# Altium schematic sheet HEADERS_UNOQ_FEMALE.SchDoc: HEADERS UNO Q FEMALE
size A3; Author: Silvio Navaretti; CompanyName: Arduino SRL; DrawnBy: Silvio Navaretti; Engineer: Silvio Navaretti; Organization: Arduino SRL; DocumentNumber: ASX00083; SheetNumber: 3; SheetTotal: 11; RevAuthor: Silvio Navaretti
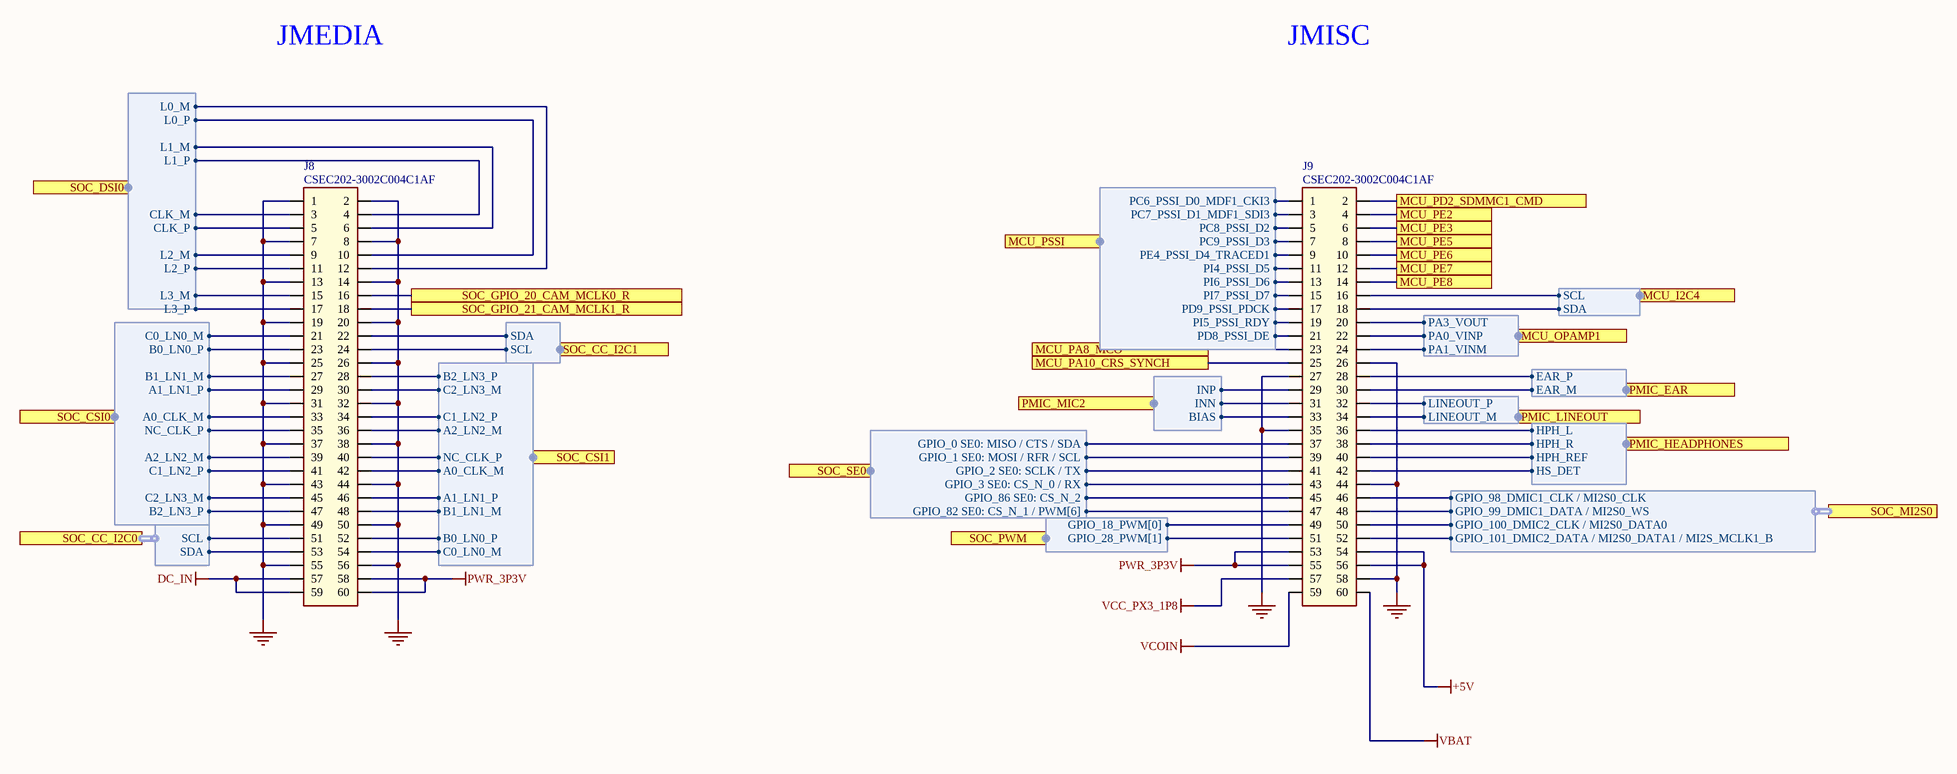
[diagram p0: HEADERS_UNOQ_FEMALE.SchDoc]

## Parts
J8  CSEC202-3002C004C1AF  [CSEC202-3002C004C1AF]
J9  CSEC202-3002C004C1AF  [CSEC202-3002C004C1AF]

## Ports
MCU_I2C4 (harness I2C), MCU_OPAMP1 (harness MCU_OPAMP), MCU_PA8_MCO, MCU_PA10_CRS_SYNCH, MCU_PD2_SDMMC1_CMD, MCU_PE2, MCU_PE3, MCU_PE5, MCU_PE6, MCU_PE7, MCU_PE8, MCU_PSSI (harness PSSI_MCU), PMIC_EAR (harness EAT), PMIC_HEADPHONES (harness HEADPHONES), PMIC_LINEOUT (harness LINEOUT), PMIC_MIC2 (harness MIC), SOC_CC_I2C0 (harness I2C), SOC_CC_I2C1 (harness I2C), SOC_CSI0 (harness IMOLA_CSI), SOC_CSI1 (harness IMOLA_CSI), SOC_DSI0 (harness IMOLA_DSI), SOC_GPIO_20_CAM_MCLK0_R, SOC_GPIO_21_CAM_MCLK1_R, SOC_MI2S0 (harness SOC_I2S), SOC_PWM (harness SOC_PWM), SOC_SE0 (harness SOC_GPIO)

## Harnesses
IMOLA_DSI: L1_P, L1_M, L3_P, L3_M, CLK_P, CLK_M, L0_P, L0_M, L2_P, L2_M
I2C: SDA, SCL
IMOLA_CSI: C2_LN3_M, A2_LN2_M, C1_LN2_P, C0_LN0_M, B0_LN0_P, A0_CLK_M, NC_CLK_P, B1_LN1_M, A1_LN1_P, B2_LN3_P
PSSI_MCU: PC6_PSSI_D0_MDF1_CKI3, PC7_PSSI_D1_MDF1_SDI3, PC8_PSSI_D2, PC9_PSSI_D3, PE4_PSSI_D4_TRACED1, PI4_PSSI_D5, PI6_PSSI_D6, PI7_PSSI_D7, PD9_PSSI_PDCK, PI5_PSSI_RDY, PD8_PSSI_DE
MCU_OPAMP: PA3_VOUT, PA0_VINP, PA1_VINM
EAT: EAR_P, EAR_M
MIC: INP, INN, BIAS
LINEOUT: LINEOUT_P, LINEOUT_M
HEADPHONES: HPH_L, HPH_R, HPH_REF, HS_DET
SOC_GPIO: GPIO_0 SE0: MISO / CTS / SDA, GPIO_1 SE0: MOSI / RFR / SCL, GPIO_2 SE0: SCLK / TX, GPIO_3 SE0: CS_N_0 / RX, GPIO_86 SE0: CS_N_2, GPIO_82 SE0: CS_N_1 / PWM[6]
SOC_PWM: GPIO_18_PWM[0], GPIO_28_PWM[1]
SOC_I2S: GPIO_98_DMIC1_CLK / MI2S0_CLK, GPIO_99_DMIC1_DATA / MI2S0_WS, GPIO_100_DMIC2_CLK / MI2S0_DATA0, GPIO_101_DMIC2_DATA / MI2S0_DATA1 / MI2S_MCLK1_B

## Nets
+5V: J9.54 J9.56
DC_IN: J8.57 J8.59
GND: J8.1 J8.2 J8.7 J8.8 J8.13 J8.14 J8.19 J8.20 J8.25 J8.26 J8.31 J8.32 J8.37 J8.38 J8.43 J8.44 J8.49 J8.50 J8.55 J8.56 J9.26 J9.27 J9.35 J9.44 J9.58
PWR_3P3V: J8.58 J8.60 J9.53 J9.55
VBAT: J9.60
VCC_PX3_1P8: J9.57
VCOIN: J9.59
MCU_PA8_MCO: J9.23 ; port MCU_PA8_MCO
MCU_PA10_CRS_SYNCH: J9.25 ; port MCU_PA10_CRS_SYNCH
MCU_PD2_SDMMC1_CMD: J9.2 ; port MCU_PD2_SDMMC1_CMD
MCU_PE2: J9.4 ; port MCU_PE2
MCU_PE3: J9.6 ; port MCU_PE3
MCU_PE5: J9.8 ; port MCU_PE5
MCU_PE6: J9.10 ; port MCU_PE6
MCU_PE7: J9.12 ; port MCU_PE7
MCU_PE8: J9.14 ; port MCU_PE8
SOC_GPIO_20_CAM_MCLK0_R: J8.16 ; port SOC_GPIO_20_CAM_MCLK0_R
SOC_GPIO_21_CAM_MCLK1_R: J8.18 ; port SOC_GPIO_21_CAM_MCLK1_R
NetJ8_3: J8.3 ; port SOC_DSI0.CLK_M
NetJ8_4: J8.4 ; port SOC_DSI0.L1_P
NetJ8_5: J8.5 ; port SOC_DSI0.CLK_P
NetJ8_6: J8.6 ; port SOC_DSI0.L1_M
NetJ8_9: J8.9 ; port SOC_DSI0.L2_M
NetJ8_10: J8.10 ; port SOC_DSI0.L0_P
NetJ8_11: J8.11 ; port SOC_DSI0.L2_P
NetJ8_12: J8.12 ; port SOC_DSI0.L0_M
NetJ8_15: J8.15 ; port SOC_DSI0.L3_M
NetJ8_17: J8.17 ; port SOC_DSI0.L3_P
NetJ8_21: J8.21 ; port SOC_CSI0.C0_LN0_M
NetJ8_22: J8.22 ; port SOC_CC_I2C1.SDA
NetJ8_23: J8.23 ; port SOC_CSI0.B0_LN0_P
NetJ8_24: J8.24 ; port SOC_CC_I2C1.SCL
NetJ8_27: J8.27 ; port SOC_CSI0.B1_LN1_M
NetJ8_28: J8.28 ; port SOC_CSI1.B2_LN3_P
NetJ8_29: J8.29 ; port SOC_CSI0.A1_LN1_P
NetJ8_30: J8.30 ; port SOC_CSI1.C2_LN3_M
NetJ8_33: J8.33 ; port SOC_CSI0.A0_CLK_M
NetJ8_34: J8.34 ; port SOC_CSI1.C1_LN2_P
NetJ8_35: J8.35 ; port SOC_CSI0.NC_CLK_P
NetJ8_36: J8.36 ; port SOC_CSI1.A2_LN2_M
NetJ8_39: J8.39 ; port SOC_CSI0.A2_LN2_M
NetJ8_40: J8.40 ; port SOC_CSI1.NC_CLK_P
NetJ8_41: J8.41 ; port SOC_CSI0.C1_LN2_P
NetJ8_42: J8.42 ; port SOC_CSI1.A0_CLK_M
NetJ8_45: J8.45 ; port SOC_CSI0.C2_LN3_M
NetJ8_46: J8.46 ; port SOC_CSI1.A1_LN1_P
NetJ8_47: J8.47 ; port SOC_CSI0.B2_LN3_P
NetJ8_48: J8.48 ; port SOC_CSI1.B1_LN1_M
NetJ8_51: J8.51 ; port SOC_CC_I2C0.SCL
NetJ8_52: J8.52 ; port SOC_CSI1.B0_LN0_P
NetJ8_53: J8.53 ; port SOC_CC_I2C0.SDA
NetJ8_54: J8.54 ; port SOC_CSI1.C0_LN0_M
NetJ9_1: J9.1 ; port MCU_PSSI.PC6_PSSI_D0_MDF1_CKI3
NetJ9_3: J9.3 ; port MCU_PSSI.PC7_PSSI_D1_MDF1_SDI3
NetJ9_5: J9.5 ; port MCU_PSSI.PC8_PSSI_D2
NetJ9_7: J9.7 ; port MCU_PSSI.PC9_PSSI_D3
NetJ9_9: J9.9 ; port MCU_PSSI.PE4_PSSI_D4_TRACED1
NetJ9_11: J9.11 ; port MCU_PSSI.PI4_PSSI_D5
NetJ9_13: J9.13 ; port MCU_PSSI.PI6_PSSI_D6
NetJ9_15: J9.15 ; port MCU_PSSI.PI7_PSSI_D7
NetJ9_16: J9.16 ; port MCU_I2C4.SCL
NetJ9_17: J9.17 ; port MCU_PSSI.PD9_PSSI_PDCK
NetJ9_18: J9.18 ; port MCU_I2C4.SDA
NetJ9_19: J9.19 ; port MCU_PSSI.PI5_PSSI_RDY
NetJ9_20: J9.20 ; port MCU_OPAMP1.PA3_VOUT
NetJ9_21: J9.21 ; port MCU_PSSI.PD8_PSSI_DE
NetJ9_22: J9.22 ; port MCU_OPAMP1.PA0_VINP
NetJ9_24: J9.24 ; port MCU_OPAMP1.PA1_VINM
NetJ9_28: J9.28 ; port PMIC_EAR.EAR_P
NetJ9_29: J9.29 ; port PMIC_MIC2.INP
NetJ9_30: J9.30 ; port PMIC_EAR.EAR_M
NetJ9_31: J9.31 ; port PMIC_MIC2.INN
NetJ9_32: J9.32 ; port PMIC_LINEOUT.LINEOUT_P
NetJ9_33: J9.33 ; port PMIC_MIC2.BIAS
NetJ9_34: J9.34 ; port PMIC_LINEOUT.LINEOUT_M
NetJ9_36: J9.36 ; port PMIC_HEADPHONES.HPH_L
NetJ9_37: J9.37 ; port SOC_SE0.GPIO_0 SE0: MISO / CTS / SDA
NetJ9_38: J9.38 ; port PMIC_HEADPHONES.HPH_R
NetJ9_39: J9.39 ; port SOC_SE0.GPIO_1 SE0: MOSI / RFR / SCL
NetJ9_40: J9.40 ; port PMIC_HEADPHONES.HPH_REF
NetJ9_41: J9.41 ; port SOC_SE0.GPIO_2 SE0: SCLK / TX
NetJ9_42: J9.42 ; port PMIC_HEADPHONES.HS_DET
NetJ9_43: J9.43 ; port SOC_SE0.GPIO_3 SE0: CS_N_0 / RX
NetJ9_45: J9.45 ; port SOC_SE0.GPIO_86 SE0: CS_N_2
NetJ9_46: J9.46 ; port SOC_MI2S0.GPIO_98_DMIC1_CLK / MI2S0_CLK
NetJ9_47: J9.47 ; port SOC_SE0.GPIO_82 SE0: CS_N_1 / PWM[6]
NetJ9_48: J9.48 ; port SOC_MI2S0.GPIO_99_DMIC1_DATA / MI2S0_WS
NetJ9_49: J9.49 ; port SOC_PWM.GPIO_18_PWM[0]
NetJ9_50: J9.50 ; port SOC_MI2S0.GPIO_100_DMIC2_CLK / MI2S0_DATA0
NetJ9_51: J9.51 ; port SOC_PWM.GPIO_28_PWM[1]
NetJ9_52: J9.52 ; port SOC_MI2S0.GPIO_101_DMIC2_DATA / MI2S0_DATA1 / MI2S_MCLK1_B

## Notes on the sheet
- JMEDIA
- JMISC
- Title:
- ID:
- Date:
- Time:
- Version:
- Sheet
- of
- RevAuthor:
- Reference Designs ARE PROVIDED "AS IS" AND "WITH ALL FAULTS. Arduino SA DISCLAIMS ALL OTHER WARRANTIES, EXPRESS OR IMPLIED, REGARDING PRODUCTS, INCLUDING BUT NOT LIMITED TO, ANY IMPLIED WARRANTIES OF MERCHANTABILITY OR FITNESS FOR A PARTICULAR PURPOSE.
  Arduino SA may make changes to specifications and product descriptions at any time, without notice. The Customer must not rely on the absence or characteristics of any features or instructions marked "reserved" or "undefined".
  Arduino SA reserves these for future definition and shall have no responsibility whatsoever for conflicts or incompatibilities arising from future changes to them. The product information on the Web Site or Materials is subject to change without notice.
  Do not finalize a design with this info. ARDUINO and other Arduino brands and logos and Trademarks of Arduino SA. All Arduino SA Trademarks cannot be used without owner's formal permission.
- File:
- Author:

## Library data of the parts
J8 J9 = J0575-A.2: CONN HEADER FEMALE VERTICAL SMD 1.27mm 2x30 POS heigth 4.6mm FIXING PINS; Manufacturer: Greenconn; Code Arduino: J0575; Part Number: CSEC202-3002C004C1AF